# Altium schematic sheet interface.SchDoc
size 420 x 297 mm; SheetNumber: 2
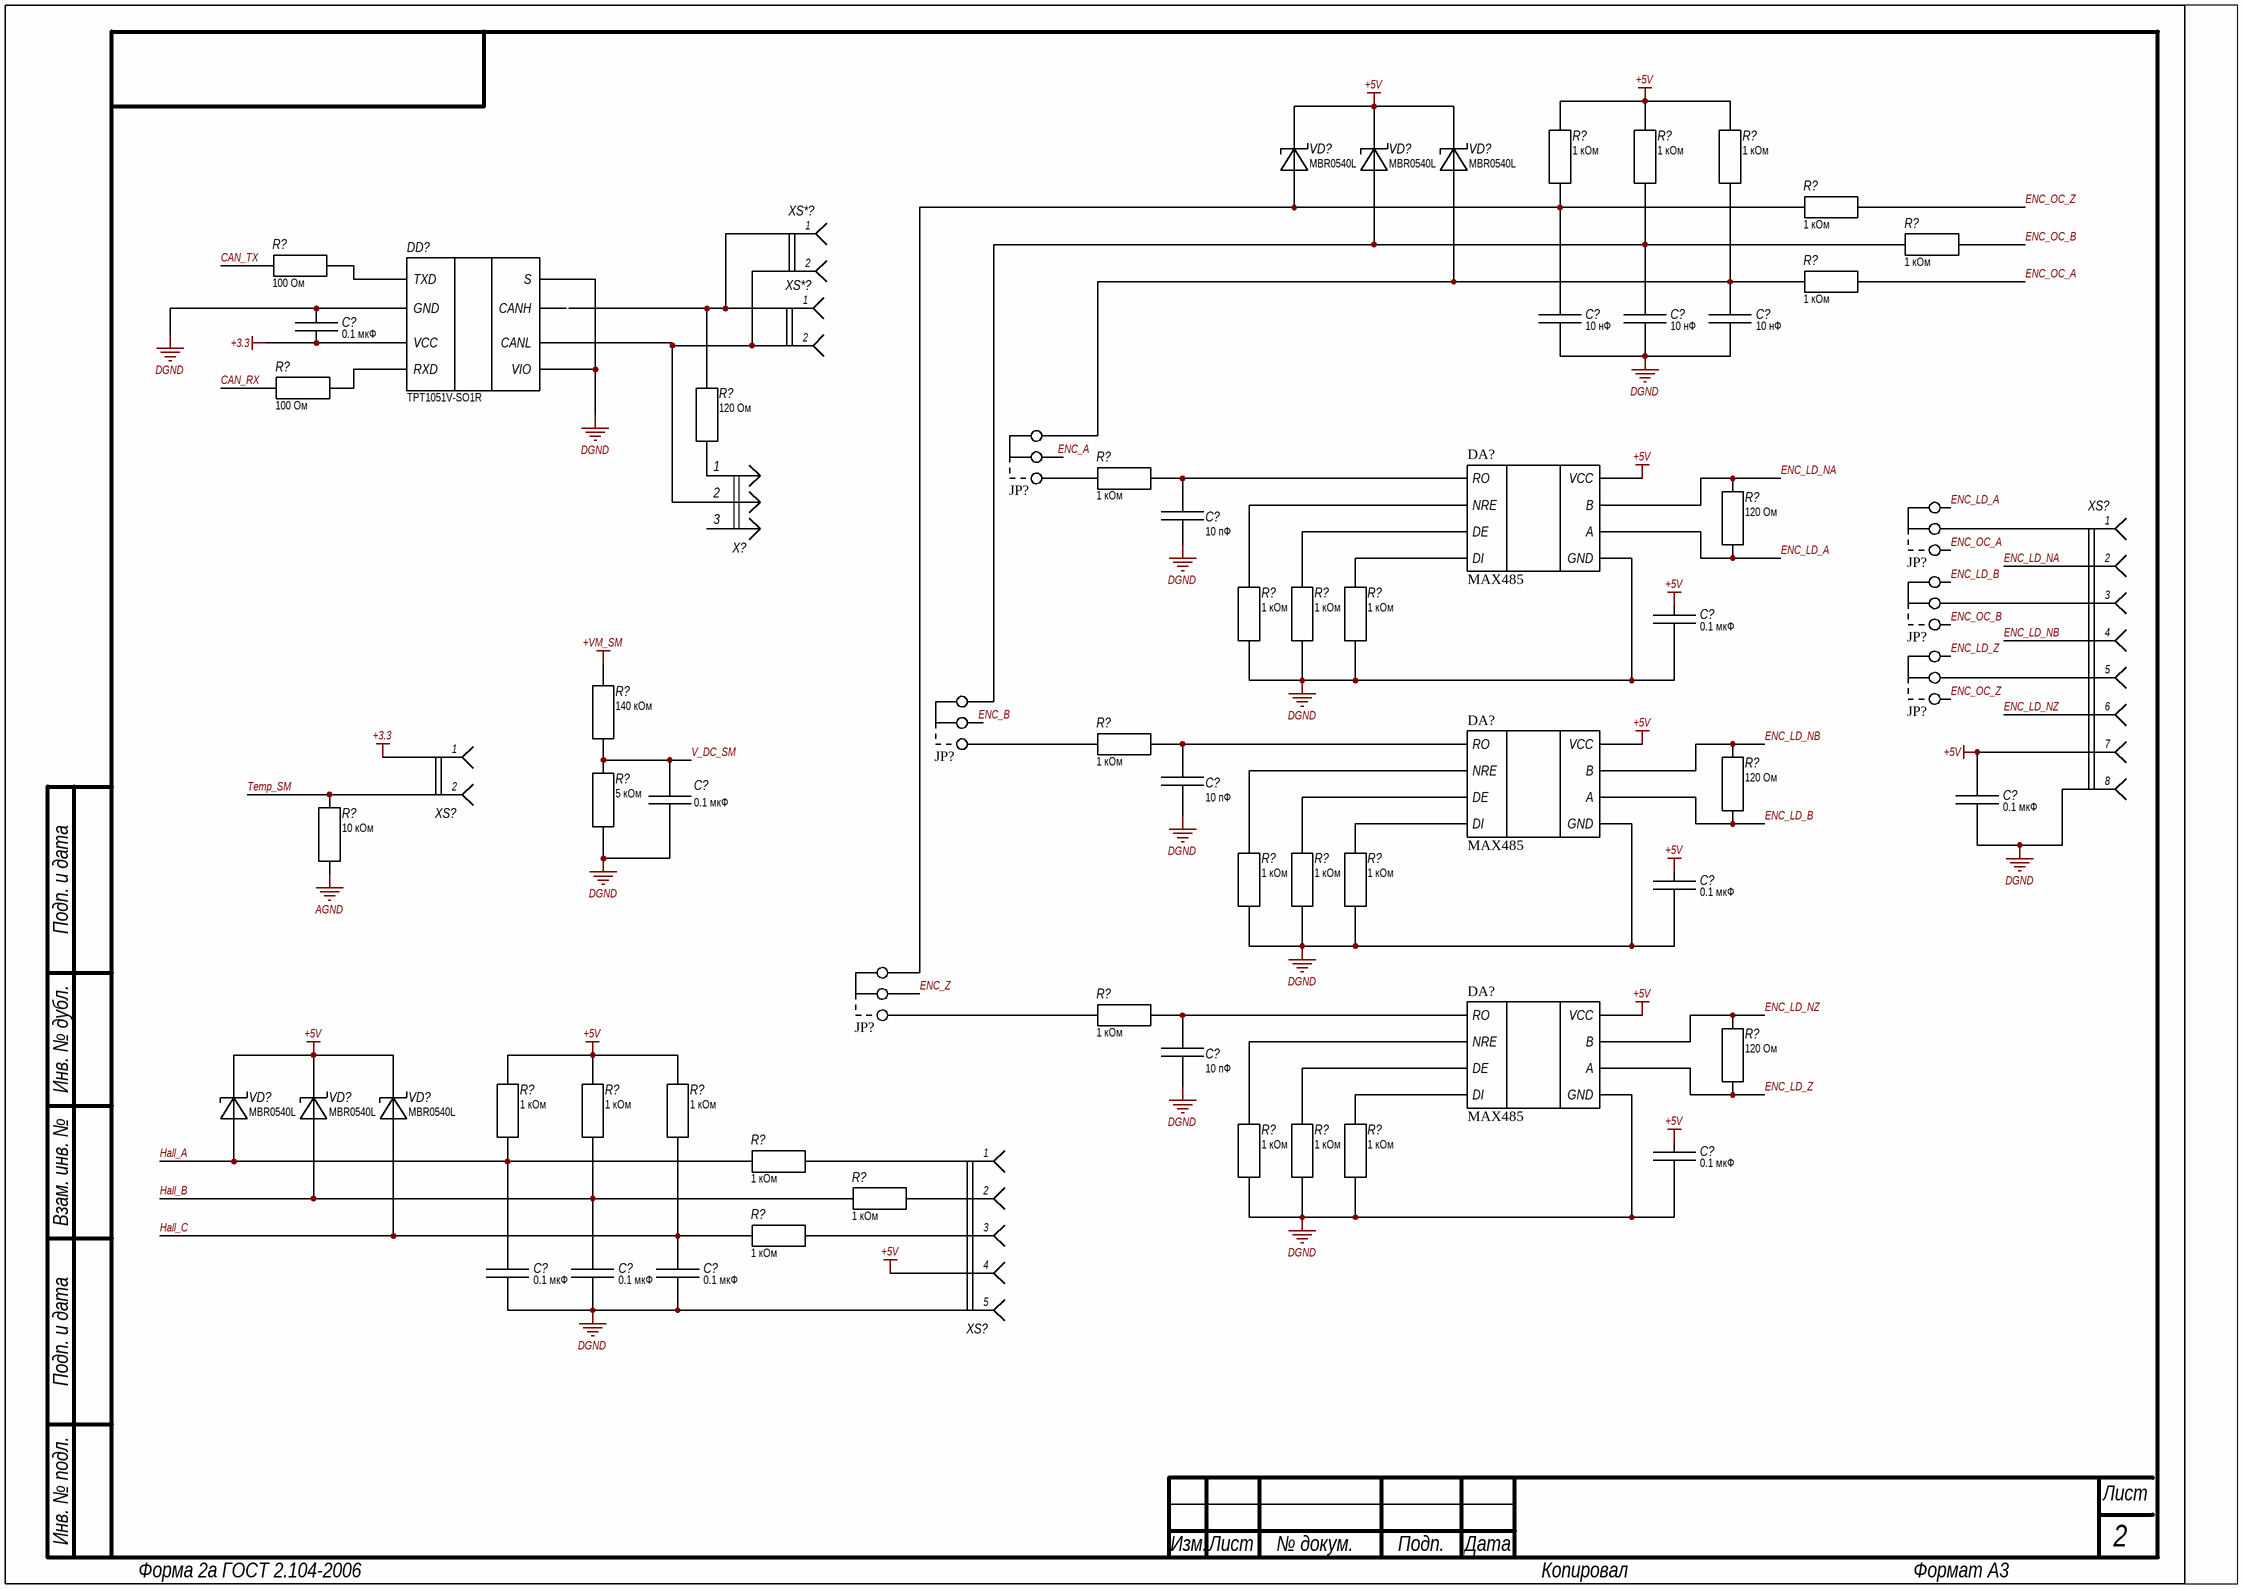
[diagram p0: interface.SchDoc]

## Parts
(Parts that share a designator on the sheet are numbered #1, #2 ... from top to bottom, then left to right.)
C?#1  value 10 нФ  [CC0805]  (hidden comment: Capacitor)
C?#2  value 10 нФ  [CC0805]  (hidden comment: Capacitor)
C?#3  value 10 нФ  [CC0603]  (hidden comment: Capacitor)
C?#4  value 0.1 мкФ  [CC0603]  (hidden comment: Capacitor)
C?#5  value 10 пФ  [CC0603]  (hidden comment: Capacitor)
C?#6  value 0.1 мкФ  [CC0603]  (hidden comment: Capacitor)
C?#7  value 10 пФ  [CC0603]  (hidden comment: Capacitor)
C?#8  value 0.1 мкФ  [CC0805]  (hidden comment: Capacitor)
C?#9  value 0.1 мкФ  [CC0603]  (hidden comment: Capacitor)
C?#10  value 0.1 мкФ  [CC0603]  (hidden comment: Capacitor)
C?#11  value 10 пФ  [CC0603]  (hidden comment: Capacitor)
C?#12  value 0.1 мкФ  [CC0603]  (hidden comment: Capacitor)
C?#13  value 0.1 мкФ  [CC0805]  (hidden comment: Capacitor)
C?#14  value 0.1 мкФ  [CC0805]  (hidden comment: Capacitor)
C?#15  value 0.1 мкФ  [CC0805]  (hidden comment: Capacitor)
DA?#1  MAX485  [SO8]
DA?#2  MAX485  [SO8]
DA?#3  MAX485  [SO8]
DD?  TPT1051V-SO1R  [SO8]
JP?#1  Jumper  [PLS3]  (value not drawn)
JP?#2  Jumper  [PLS3]  (value not drawn)
JP?#3  Jumper  [PLS3]  (value not drawn)
JP?#4  Jumper  [PLS3]  (value not drawn)
JP?#5  Jumper  [PLS3]  (value not drawn)
JP?#6  Jumper  [PLS3]  (value not drawn)
R?#1  value 1 кОм  [RC1206]  (hidden comment: Resistor)
R?#2  value 1 кОм  [RC1206]  (hidden comment: Resistor)
R?#3  value 1 кОм  [RC1206]  (hidden comment: Resistor)
R?#4  value 1 кОм  [RC1206]  (hidden comment: Resistor)
R?#5  value 1 кОм  [RC1206]  (hidden comment: Resistor)
R?#6  value 100 Ом  [RC0603]  (hidden comment: Resistor)
R?#7  value 1 кОм  [RC1206]  (hidden comment: Resistor)
R?#8  value 100 Ом  [RC0603]  (hidden comment: Resistor)
R?#9  value 120 Ом  [RC1206]  (hidden comment: Resistor)
R?#10  value 1 кОм  [RC0603]  (hidden comment: Resistor)
R?#11  value 120 Ом  [RC1206]  (hidden comment: Resistor)
R?#12  value 1 кОм  [RC0603]  (hidden comment: Resistor)
R?#13  value 1 кОм  [RC0603]  (hidden comment: Resistor)
R?#14  value 1 кОм  [RC0603]  (hidden comment: Resistor)
R?#15  value 1 кОм  [RC0603]  (hidden comment: Resistor)
R?#16  value 120 Ом  [RC1206]  (hidden comment: Resistor)
R?#17  value 140 кОм  [RC1206]  (hidden comment: Resistor)
R?#18  value 5 кОм  [RC1206]  (hidden comment: Resistor)
R?#19  value 10 кОм  [RC0805]  (hidden comment: Resistor)
R?#20  value 1 кОм  [RC0603]  (hidden comment: Resistor)
R?#21  value 1 кОм  [RC0603]  (hidden comment: Resistor)
R?#22  value 1 кОм  [RC0603]  (hidden comment: Resistor)
R?#23  value 1 кОм  [RC0603]  (hidden comment: Resistor)
R?#24  value 120 Ом  [RC1206]  (hidden comment: Resistor)
R?#25  value 1 кОм  [RC1206]  (hidden comment: Resistor)
R?#26  value 1 кОм  [RC1206]  (hidden comment: Resistor)
R?#27  value 1 кОм  [RC1206]  (hidden comment: Resistor)
R?#28  value 1 кОм  [RC1206]  (hidden comment: Resistor)
R?#29  value 1 кОм  [RC0603]  (hidden comment: Resistor)
R?#30  value 1 кОм  [RC0603]  (hidden comment: Resistor)
R?#31  value 1 кОм  [RC0603]  (hidden comment: Resistor)
R?#32  value 1 кОм  [RC1206]  (hidden comment: Resistor)
R?#33  value 1 кОм  [RC1206]  (hidden comment: Resistor)
VD?#1  MBR0540L  [SOD123]
VD?#2  MBR0540L  [SOD123]
VD?#3  MBR0540L  [SOD123]
VD?#4  MBR0540L  [SOD123]
VD?#5  MBR0540L  [SOD123]
VD?#6  MBR0540L  [SOD123]
X?  PLS-3  [PLS3]  (value not drawn)
XS*?#1  DG141V-2.54-02P-14-00AH  [DG141V-2.54-02P]  (value not drawn)
XS*?#2  DG141V-2.54-02P-14-00AH  [DG141V-2.54-02P]  (value not drawn)
XS?#1  DG141V-2.54-05P-14-00AH  [DG141V-2.54-08P]  (value not drawn)
XS?#2  JST-Male-2  [JST-2]  (value not drawn)
XS?#3  DG141V-2.54-05P-14-00AH  [DG141V-2.54-05P]  (value not drawn)

## Nets
+3.3: C?#4.1 DD?.3(VCC) XS?#2.1
+5V: C?#6.2 C?#9.2 C?#10.2 C?#12.2 DA?#1.5(VCC) DA?#2.5(VCC) DA?#3.5(VCC) R?#1.2 R?#2.2 R?#3.2 R?#25.2 R?#26.2 R?#27.2 VD?#1.C VD?#2.C VD?#3.C VD?#4.C VD?#5.C VD?#6.C XS?#1.7 XS?#3.4
+VM_SM: R?#17.1
AGND: R?#19.2
DGND: C?#1.1 C?#2.1 C?#3.1 C?#4.2 C?#5.2 C?#6.1 C?#7.2 C?#8.1 C?#9.1 C?#10.1 C?#11.2 C?#12.1 C?#13.1 C?#14.1 C?#15.1 DA?#1.8(GND) DA?#2.8(GND) DA?#3.8(GND) DD?.2(GND) DD?.5(VIO) DD?.8(S) R?#12.2 R?#13.2 R?#14.2 R?#18.2 R?#20.2 R?#21.2 R?#22.2 R?#29.2 R?#30.2 R?#31.2 XS?#1.8 XS?#3.5
CAN_RX: R?#8.2
CAN_TX: R?#6.2
ENC_A: JP?#1.2
ENC_B: JP?#5.2
ENC_LD_A: DA?#1.7(A) JP?#2.3 R?#11.1
ENC_LD_B: DA?#2.7(A) JP?#3.3 R?#16.1
ENC_LD_NA: DA?#1.6(B) R?#11.2 XS?#1.2
ENC_LD_NB: DA?#2.6(B) R?#16.2 XS?#1.4
ENC_LD_NZ: DA?#3.6(B) R?#24.2 XS?#1.6
ENC_LD_Z: DA?#3.7(A) JP?#4.3 R?#24.1
ENC_OC_A: JP?#2.1 R?#7.2
ENC_OC_B: JP?#3.1 R?#5.2
ENC_OC_Z: JP?#4.1 R?#4.2
ENC_Z: JP?#6.2
Hall_A: C?#13.2 R?#25.1 R?#28.1 VD?#4.A
Hall_B: C?#14.2 R?#26.1 R?#32.1 VD?#5.A
Hall_C: C?#15.2 R?#27.1 R?#33.1 VD?#6.A
Temp_SM: R?#19.1 XS?#2.2
V_DC_SM: C?#8.2 R?#17.2 R?#18.1
NetC?#1_2: C?#1.2 JP?#6.3 R?#1.1 R?#4.1 VD?#1.A
NetC?#2_2: C?#2.2 JP?#5.3 R?#2.1 R?#5.1 VD?#2.A
NetC?#3_2: C?#3.2 JP?#1.3 R?#3.1 R?#7.1 VD?#3.A
NetC?#5_1: C?#5.1 DA?#1.1(RO) R?#10.1
NetC?#7_1: C?#7.1 DA?#2.1(RO) R?#15.1
NetC?#11_1: C?#11.1 DA?#3.1(RO) R?#23.1
NetDA?#1_2: DA?#1.2(NRE) R?#12.1
NetDA?#1_3: DA?#1.3(DE) R?#13.1
NetDA?#1_4: DA?#1.4(DI) R?#14.1
NetDA?#2_2: DA?#2.2(NRE) R?#20.1
NetDA?#2_3: DA?#2.3(DE) R?#21.1
NetDA?#2_4: DA?#2.4(DI) R?#22.1
NetDA?#3_2: DA?#3.2(NRE) R?#29.1
NetDA?#3_3: DA?#3.3(DE) R?#30.1
NetDA?#3_4: DA?#3.4(DI) R?#31.1
NetDD?_1: DD?.1(TXD) R?#6.1
NetDD?_4: DD?.4(RXD) R?#8.1
NetDD?_6: DD?.6(CANL) X?.2 XS*?#1.2 XS*?#2.2
NetJP?#1_1: JP?#1.1 R?#10.2
NetJP?#2_2: JP?#2.2 XS?#1.1
NetJP?#3_2: JP?#3.2 XS?#1.3
NetJP?#4_2: JP?#4.2 XS?#1.5
NetJP?#5_1: JP?#5.1 R?#15.2
NetJP?#6_1: JP?#6.1 R?#23.2
NetR?#9_1: R?#9.1 XS*?#1.1 XS*?#2.1
NetR?#9_2: R?#9.2 X?.1
NetR?#28_2: R?#28.2 XS?#3.1
NetR?#32_2: R?#32.2 XS?#3.2
NetR?#33_2: R?#33.2 XS?#3.3

Not connected (* = marked no-connect by the designer): DD? 7(CANH); X? 3

## Notes on the sheet
- Подп. и дата
- Инв. № дубл.
- Взам. инв. №
- Инв. № подл.
- Изм.
- Лист
- № докум.
- Подп.
- Дата
- Форма 2а ГОСТ 2.104-2006
- Копировал
- Формат А3

## Library data of the parts
C?#1 C?#2 C?#4 C?#6 C?#9 C?#10 C?#12 = Capacitor: Voltage: 16В; ComponentLink1Description: Product link; ComponentLink1URL: *; GOST_Name_1: =Name; GOST_Name_2: 16В; GOST_Name_0: -
  C?#1 C?#2: Name: CC0805; GOST_Name_3: 10 нФ
  C?#4 C?#6 C?#9 C?#10 C?#12: Name: CC0603; GOST_Name_3: 0.1 мкФ
C?#3 C?#5 C?#7 C?#11 C?#13-C?#15 = Capacitor: Voltage: 50В; ComponentLink1Description: Product link; ComponentLink1URL: *; GOST_Name_1: =Name; GOST_Name_2: 50В; GOST_Name_0: -
  C?#3: Name: CC0603; GOST_Name_3: 10 нФ
  C?#5 C?#7 C?#11: Name: CC0603; GOST_Name_3: 10 пФ
  C?#13-C?#15: Name: CC0805; GOST_Name_3: 0.1 мкФ
C?#8 = Capacitor: Voltage: 50 В; ComponentLink1Description: Product link; ComponentLink1URL: *; Name: CC0805; GOST_Name_1: =Name; GOST_Name_2: 50 В; GOST_Name_3: 0.1 мкФ; GOST_Name_0: -
DA?#1-DA?#3 = MAX485ESA: GOST_Name_1: MAX485ESA+ ф. Maxim Integrated; ComponentLink1Description: Product link; ComponentLink1URL: https://www.platan.ru/cgi-bin/qwery.pl/id=355590810; Datasheet: https://doc.platan.ru/pdf/datasheets/maxim/MAX1487E-MAX491E-101921.pdf
DD? = TPT1051V-SO1R: Физический уровень CAN; GOST_Name_1: TPT1051V-SO1R, ф. 3PEAK INCORPORATED; ComponentLink1Description: New link; ComponentLink1URL: https://www.chipdip.ru/product/max3051esa-maxim
R?#1-R?#5 R?#7 R?#9 R?#11 R?#16-R?#18 R?#24-R?#28 R?#32 R?#33 = Resistor: Power: 250 мВт; ComponentLink1Description: Product link; ComponentLink1URL: *; Name: RC1206; GOST_Name_1: =Name; GOST_Name_2: 250 мВт; GOST_Name_0: -
  R?#1-R?#5 R?#7 R?#25-R?#28 R?#32 R?#33: GOST_Name_3: 1 кОм
  R?#9 R?#11 R?#16 R?#24: GOST_Name_3: 120 Ом
  R?#17: GOST_Name_3: 140 кОм
  R?#18: GOST_Name_3: 5 кОм
R?#6 R?#8 R?#12-R?#14 R?#20-R?#22 R?#29-R?#31 = Resistor: Power: 100 мВт; ComponentLink1Description: Product link; ComponentLink1URL: *; Name: RC0603; GOST_Name_1: =Name; GOST_Name_2: 100 мВт; GOST_Name_0: -
  R?#6 R?#8: GOST_Name_3: 100 Ом
  R?#12-R?#14 R?#20-R?#22 R?#29-R?#31: GOST_Name_3: 1 кОм
R?#10 R?#15 R?#23 = Resistor: Power: 100мВт; ComponentLink1Description: Product link; ComponentLink1URL: *; Name: RC0603; GOST_Name_1: =Name; GOST_Name_2: 100мВт; GOST_Name_3: 1 кОм; GOST_Name_0: -
R?#19 = Resistor: Power: 125 мВт; ComponentLink1Description: Product link; ComponentLink1URL: *; Name: RC0805; GOST_Name_1: =Name; GOST_Name_2: 125 мВт; GOST_Name_3: 10 кОм; GOST_Name_0: -
VD?#1-VD?#6 = Shotki: Name: MBR0540L, 40В, 0.5А, ф. Hottech; ComponentLink1Description: Product link; GOST_Name_1: MBR0540L, 40В, 0.5А, ф. Hottech
X? = PLS-3: Name: Вилка штыревая 2.54мм 1x3; ComponentLink1Description: Product link
XS*?#1 XS*?#2 = DG141V-2.54-02P-14-00AH: GOST_Name_1: DG141V-2.54-02P-14-00AH, ф. Degson Electronics Co; ComponentLink1Description: Product link; ComponentLink1URL: https://www.promelec.ru/product/403282/
XS?#1 = DG141V-2.54-08P-14-00A(H): Name: DG141V-2.54-08P-14-00A(H), ф. Degson Electronics Co; ComponentLink1Description: Product link; ComponentLink1URL: https://www.promelec.ru/product/102606/; GOST_Name_1: DG141V-2.54-08P-14-00A(H), ф. Degson Electronics Co
XS?#2 = JST-Male-2: Name: JST-2.54 x2; GOST_Name_1: JST-2.54 x2
XS?#3 = DG141V-2.54-05P-14-00AH: Name: DG141V-2.54-05P-14-00AH, ф. Degson Electronics Co; ComponentLink1Description: Product link; ComponentLink1URL: https://www.promelec.ru/product/403282/; GOST_Name_1: DG141V-2.54-05P-14-00AH, ф. Degson Electronics Co
JP?#1-JP?#6 = Jumper: ComponentLink1Description: Product link; ComponentLink1URL: https://www.chipdip.ru/product/stps2h100a-2